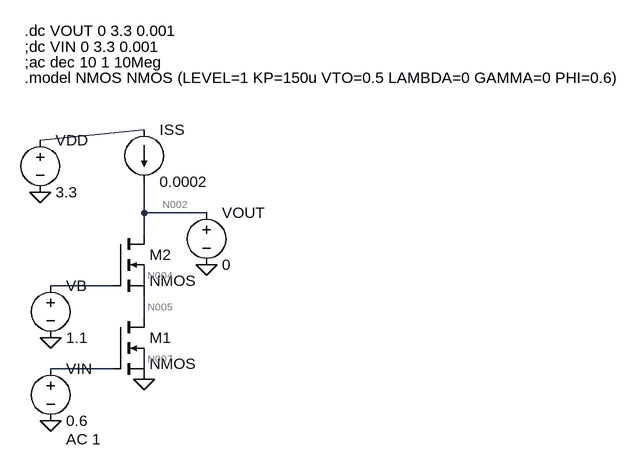
[diagram p0: schematic E3h.asc]
E3h.asc, the LTspice schematic file:
Version 4
SHEET 1 892 680
WIRE -64 -240 96 -256
WIRE 96 -128 96 -176
WIRE 192 -128 96 -128
WIRE 96 -96 96 -128
WIRE 48 -16 -48 -16
WIRE 96 -16 96 -48
WIRE 96 32 96 0
WIRE 48 112 -48 112
WIRE 96 112 96 80
FLAG 96 128 0
FLAG -48 64 0
FLAG -48 192 0
FLAG -64 -160 0
FLAG 192 -48 0
SYMBOL nmos4 48 32 R0
SYMATTR InstName M1
SYMATTR Value2 l=0.18u w=18u
SYMBOL nmos4 48 -96 R0
SYMATTR InstName M2
SYMATTR Value2 l=0.36u w=18u
SYMBOL voltage -64 -256 R0
WINDOW 123 0 0 Left 0
WINDOW 39 0 0 Left 0
SYMATTR InstName VDD
SYMATTR Value 3.3
SYMBOL voltage -48 -32 R0
WINDOW 123 0 0 Left 0
WINDOW 39 0 0 Left 0
SYMATTR InstName VB
SYMATTR Value 1.1
SYMBOL voltage -48 96 R0
WINDOW 123 24 124 Left 2
WINDOW 39 0 0 Left 0
SYMATTR Value2 AC 1
SYMATTR InstName VIN
SYMATTR Value 0.6
SYMBOL voltage 192 -144 R0
WINDOW 123 0 0 Left 0
WINDOW 39 0 0 Left 0
SYMATTR InstName VOUT
SYMATTR Value 0
SYMBOL current 96 -256 R0
SYMATTR InstName ISS
SYMATTR Value 0.0002
TEXT -88 -384 Left 2 !;dc VIN 0 3.3 0.001
TEXT -88 -360 Left 2 !;ac dec 10 1 10Meg
TEXT -88 -336 Left 2 !.model NMOS NMOS (LEVEL=1 KP=150u VTO=0.5 LAMBDA=0 GAMMA=0 PHI=0.6)
TEXT -88 -408 Left 2 !.dc VOUT 0 3.3 0.001

The netlist it stands for:
* E3h.asc
M1 N005 N006 0 N007 NMOS l=0.18u w=18u
M2 N002 N003 N005 N004 NMOS l=0.36u w=18u
VDD N001 0 3.3
VB N003 0 1.1
VIN N006 0 0.6 AC 1
VOUT N002 0 0
ISS N001 N002 0.0002
.model NMOS NMOS
.model PMOS PMOS
.lib standard.mos
;dc VIN 0 3.3 0.001
;ac dec 10 1 10Meg
.model NMOS NMOS (LEVEL=1 KP=150u VTO=0.5 LAMBDA=0 GAMMA=0 PHI=0.6)
.dc VOUT 0 3.3 0.001
.backanno
.end

* Results of the author's LTspice run, read from the files saved beside the schematic
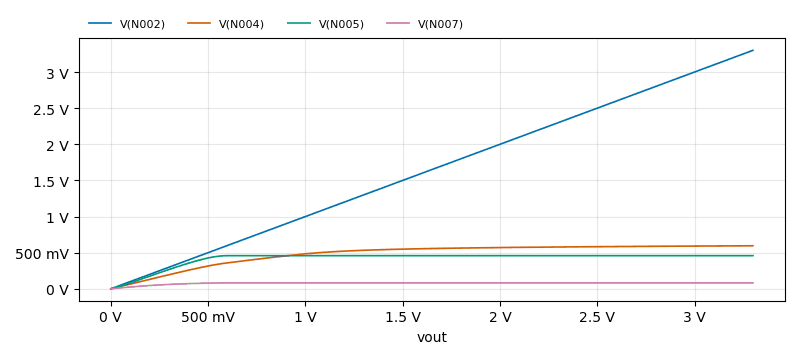
[diagram p1: DC transfer characteristic of E3h.asc, plotted from the saved traces]
* DC transfer characteristic, 1 run:
*   V(N002): 0 V at vout=0 V, 3.3 V at vout=3.3 V, min 0 V, max 3.3 V
*   V(N004): 163.8 fV at vout=0 V, 595.5 mV at vout=3.3 V, min 163.8 fV, max 595.5 mV
*   V(N005): -2.027e-05 fV at vout=0 V, 458.6 mV at vout=3.3 V, min -2.027e-05 fV, max 458.6 mV
*   V(N007): 163.8 fV at vout=0 V, 81.54 mV at vout=3.3 V, min 163.8 fV, max 81.54 mV